# EasyEDA Pro project BLDCV6-nerdyintern.eprj, board PCB2
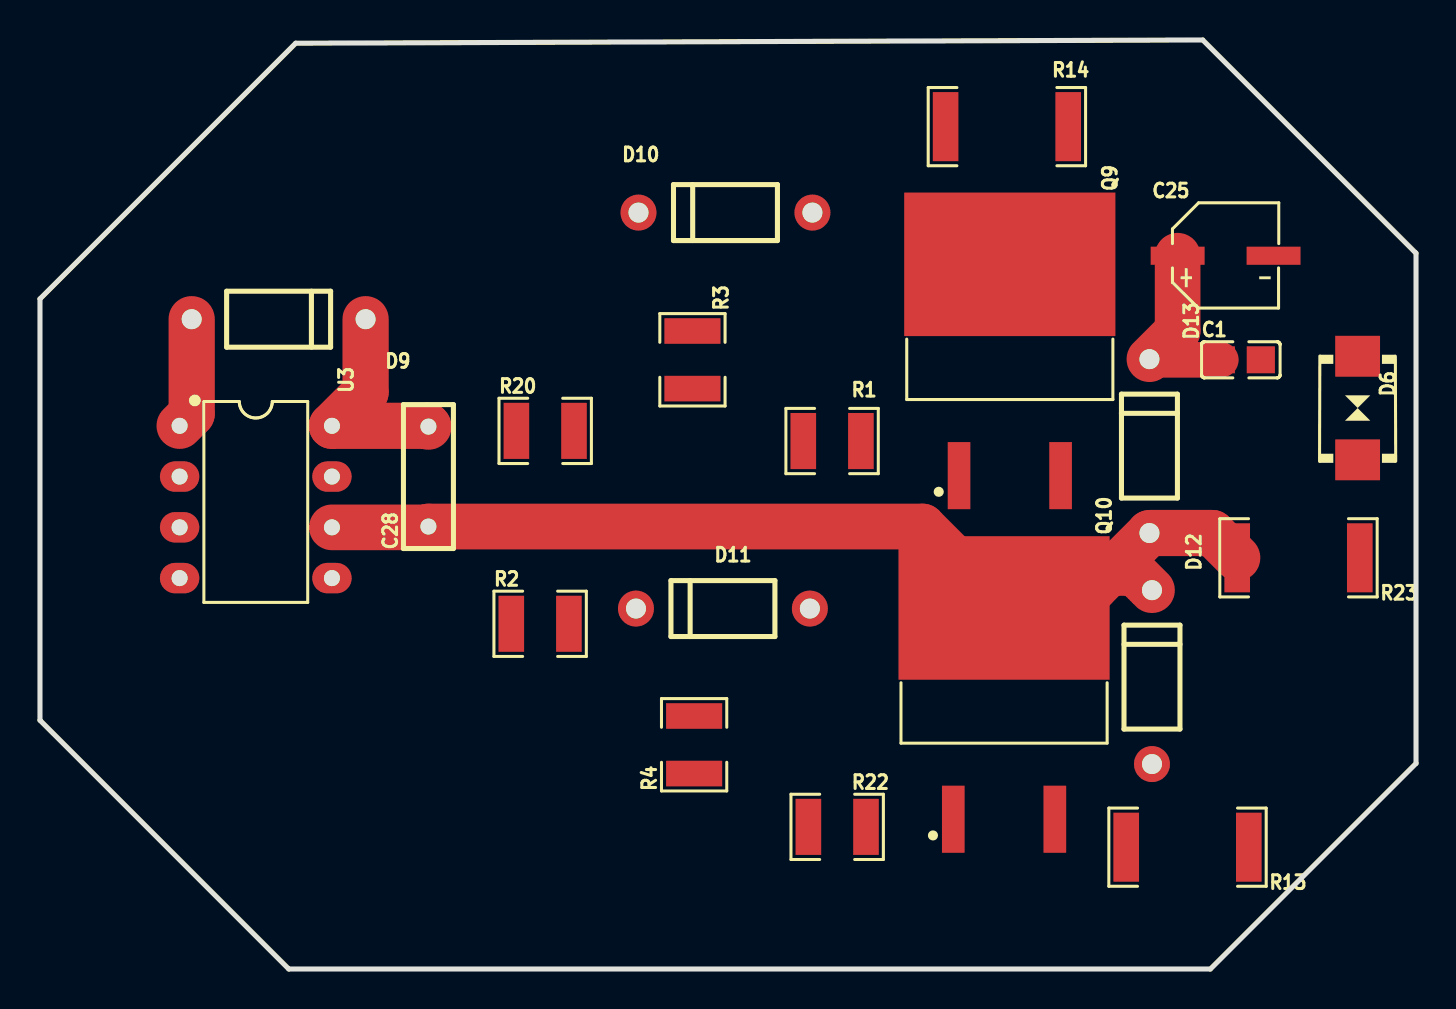
[diagram p7: board, top side]
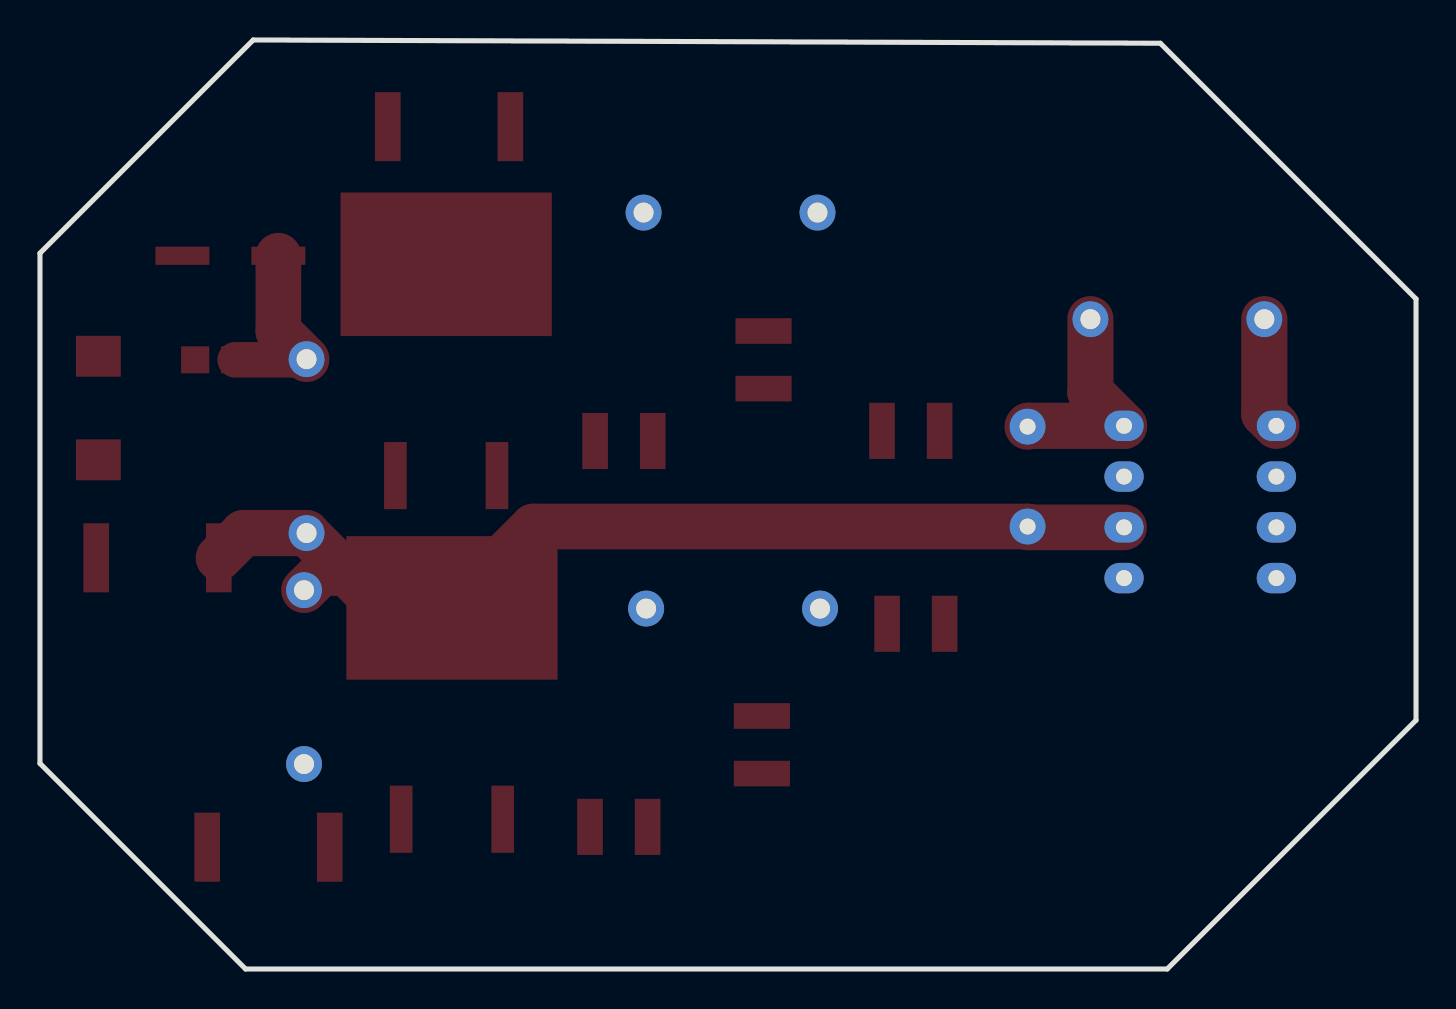
[diagram p8: board, bottom side, seen from below]

Outline 68.83 x 46.48 mm; copper layers: Top Layer, Bottom Layer. Coordinates in mm from the lower left corner of the outline.
Outline path: 0,33.53 0,12.45 12.45,0 58.55,0 68.83,10.29 68.83,35.81 58.17,46.48 12.79,46.32 0,33.53
Stack: Top Layer 0.035mm / Dielectric1 1.51mm FR4 er 4.5 / Bottom Layer 0.035mm

## Design rules (mm)
template: JLCPCB Capability(Two Layers Board)
spacing copperThickness1oz (default): track to track 0.102, other pairs 0.152 to 0.3
spacing copperThickness2oz: track to track 0.203, other pairs 0.152 to 0.3
track width copperThickness1oz (default): min 0.127, default 0.254, max 2.54
track width copperThickness2oz: min 0.203, default 0.254, max 2.54
differential pair differentialPair (default): width min 0.127, default 0.254, max 2.54; gap min 0.152, default 0.152
via viaSize (default): diameter min 0.5, default 0.61, max 10; hole min 0.3, default 0.305, max 6.3

## Placement (name value [footprint] x y rotation side)
C1  100nF  [C0805]  60.07 30.48 0 top
C25  10uF  [CAP-SMD_BD5.0-L5.3-W5.3-LS6.3-FD]  59.31 35.69 0 top
C28  1uF  [CAP-TH_L7.2-W2.5-P5.00-D0.6]  19.43 24.64 90 top
D6  P6SMB6.8CA/TR13  [SMB_L4.6-W3.6-LS5.3-BI]  65.91 28.07 270 top
D9  -  [DO-41_BD2.4-L4.7-P8.70-D0.9-RD]  11.94 32.51 180 top
D10  -  [DO-41_BD2.4-L4.7-P8.70-D0.9-RD]  34.29 37.85 0 top
D11  -  [DO-41_BD2.4-L4.7-P8.70-D0.9-RD]  34.16 18.03 0 top
D12  -  [DO-41_BD2.4-L4.7-P8.70-D0.9-RD]  55.63 14.61 270 top
D13  -  [DO-41_BD2.4-L4.7-P8.70-D0.9-RD]  55.5 26.16 270 top
Q9  IRFS4010TRLPBF  [D2PAK_L9.1-W10.0-P2.54-LS15.3-BR-1]  48.51 29.97 270 top
Q10  IRFS4010TRLPBF  [D2PAK_L9.1-W10.0-P2.54-LS15.3-BR-1]  48.23 12.78 270 top
R1  [6-10]  [R1210]  39.62 26.42 0 top
R2  [20-40]  [R1210]  25.02 17.27 0 top
R3  10KΩ  [R1210]  32.64 30.48 270 top
R4  10KΩ  [R1210]  32.72 11.22 90 top
R13  5mΩ  [R2512]  57.4 6.1 180 top
R14  5mΩ  [R2512]  48.37 42.15 180 top
R20  [20-40]  [R1210]  25.27 26.92 0 top
R22  [6-10]  [R1210]  39.88 7.11 180 top
R23  5mΩ  [R2512]  62.96 20.57 180 top
U3  IR2104PBF  [DIP-8_L9.9-W6.6-P2.54-LS7.62-BL]  10.8 23.37 270 top

## Footprints (pads in the part's own frame, mm; a bottom-side part is the same pattern mirrored in y, then rotated)
C0805
  rect 1.41x1.35 smd: 1(-1,0) 2(1,0)
CAP-SMD_BD5.0-L5.3-W5.3-LS6.3-FD
  rect 2.7x0.91 smd: 1(-2.4,0) 2(2.4,0)
CAP-TH_L7.2-W2.5-P5.00-D0.6
  round 1.8 hole 0.8: 1(-2.499,0) 2(2.499,0)
D2PAK_L9.1-W10.0-P2.54-LS15.3-BR-1
  rect 3.358x1.134 smd: 1(5.285,-2.54) 3(5.285,2.54)
  rect 7.181x10.566 smd: 4(-5.286,0)
DIP-8_L9.9-W6.6-P2.54-LS7.62-BL
  oval 1.524x1.97 hole 0.8: 1(-3.81,-3.81) 2(-1.27,-3.81) 3(1.27,-3.81) 4(3.81,-3.81) 5(3.81,3.81) 6(1.27,3.81) 7(-1.27,3.81) 8(-3.81,3.81)
DO-41_BD2.4-L4.7-P8.70-D0.9-RD
  round 1.8 hole 1: 1(-4.35,0) 2(4.35,0)
R1210
  rect 1.282x2.808 smd: 1(-1.441,0) 2(1.441,0)
R2512
  rect 1.282x3.456 smd: 1(-3.067,0) 2(3.067,0)
SMB_L4.6-W3.6-LS5.3-BI
  rect 2.047x2.241 smd: 1(-2.591,0) 2(2.591,0)

## Nets
As in the schematic, except:
GND: C1.2 C25.2 D6.1 R3.1 R4.1 R13.1 U3.4

Pads without a net: U3 2 3

## Routing (per net, layer and track width the routed paths; a pad name or vN(x,y) marks a point on that pad's centre or on a via; arc(x,y) is an arc through that point)
HS_SENSE: length 9.3
  Top Layer w1.778: D13.1 55.53,30.48 C1.1
  Top Layer w2.286: D13.1 56.91,31.92 C25.1
SN_SENSE+: length 51.3
  Top Layer w2.286: 48.01,19.05 52.74,19.05 53.5,19.81 ; 53.5,19.81 D13.2 ; 53.5,19.81 54.77,19.81 D12.1 ; U3.6 19.39,22.1 C28.1 44.15,22.14 Q10.4
  Top Layer w2.312: D13.2 58.65,21.81 R23.2
VB: length 10.9
  Top Layer w2.312: D9.1 16.29,28.86 U3.8 19.39,27.18 C28.2
$1N756: length 5.6
  Top Layer w2.312: U3.1 7.59,27.78 D9.2
